# Altium schematic sheet MainBoard_V100_PSU_DIG.SchDoc
size A4; SheetNumber: 7; SheetTotal: 22; Title_: Digital Power Supply
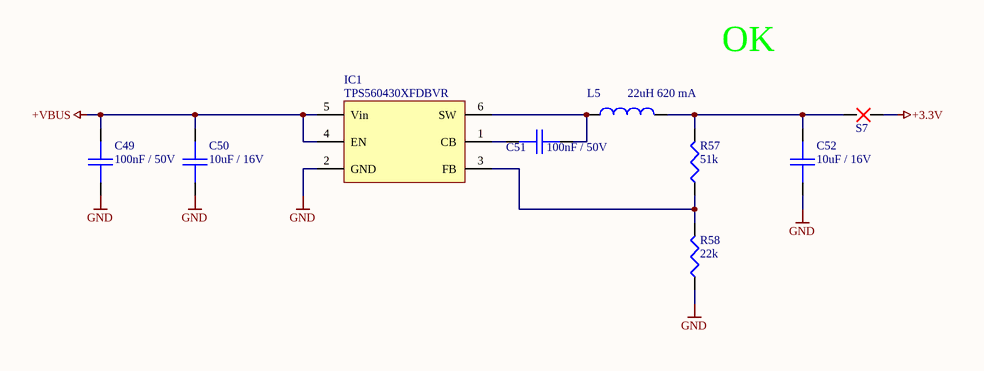
[diagram p0: MainBoard_V100_PSU_DIG.SchDoc]

## Parts
C49  100nF / 50V  [0805_C]
C50  10uF / 16V  [0805_C]
C51  100nF / 50V  [0805_C]
C52  10uF / 16V  [0805_C]
IC1  TPS560430XFDBVR  [SOT-23-6]
L5  22uH 620 mA  [1210]
R57  51k  [0805]
R58  22k  [0805]
S7  SPLITER  [SPLITER2_30mil_9mil]  (value not drawn)  (no BOM)

## Nets
+3.3V: S7.2
+VBUS: C49.1 C50.1 IC1.4(EN) IC1.5(Vin)
GND: C49.2 C50.2 C52.2 IC1.2(GND) R58.1
NetC51_1: C51.1 IC1.1(CB)
NetC51_2: C51.2 IC1.6(SW) L5.1
NetC52_1: C52.1 L5.2 R57.2 S7.1
NetIC1_3: IC1.3(FB) R57.1 R58.2

## Notes on the sheet
- OK
- Board:
- Author:
- Title:
- Project:
- SVN:
- Version:
- Sheet:
- of
- Contact:
- Modified:
- Size:
- A4

## Library data of the parts
C49 C51 = 149: 100nF 50V X7R; Part Number: SMD0805-100nF-50V; Azonosító: 149; Category: Passives; Subcategory: PASS_Capacitor; Supplier 1: HESTORE; Supplier 1 order number: 100.011.22
C50 C52 = 153: 10uF 16V X5R; Part Number: SMD0805-10uF-16V; Azonosító: 153; Category: Passives; Subcategory: PASS_Capacitor; Supplier 1: HESTORE; Supplier 1 order number: 100.344.52
IC1 = 192: SIMPLE SWITCHER 4-V to 36-V, 600-mA Synchronous Step-Down Converter; Azonosító: 192; Part Number: TPS560430XFDBVR; Category: Integrated Circuits; Subcategory: ICs__Power; Supplier 1: MOUSER; Supplier 1 order number: 595-TPS560430XFDBVR; Supplier 2: DIGIKEY; Supplier 2 order number: 296-52607-1-ND; Help URL: https://www.ti.com/general/docs/suppproductinfo.tsp?distId=26&gotoUrl=https://www.ti.com/lit/gpn/tps560430
L5 = 387: 22uH 620 mA 1210; Part Number: CBC3225T220KR; Azonosító: 387; Category: Passives; Subcategory: PASS_Inductor; Supplier 1: MOUSER; Supplier 1 order number: 963-CBC3225T220KR; Help URL: https://hu.mouser.com/datasheet/2/396/wound02_e-2256580.pdf
R57 = 64: 51k 0805 0.125W 5%; Part Number: SMD0805-51k 5%; Azonosító: 64; Category: Passives; Subcategory: PASS_Resistor; Supplier 1: HESTORE; Supplier 1 order number: 100.201.72
R58 = 388: 22k 0805 0.1W 5%; Part Number: SMD0805-22k-5%; Azonosító: 388; Category: Passives; Subcategory: PASS_Resistor; Supplier 1: HESTORE; Supplier 1 order number: 100.011.64
S7 = 272: SPLITER2_30mil_9mil; Azonosító: 272; Part Number: SPLITER2_30mil_9mil; Category: Accessories; Subcategory: ACCE_Other